# EAGLE design LME49830 Breakout Board (EAGLE 7.1.0)
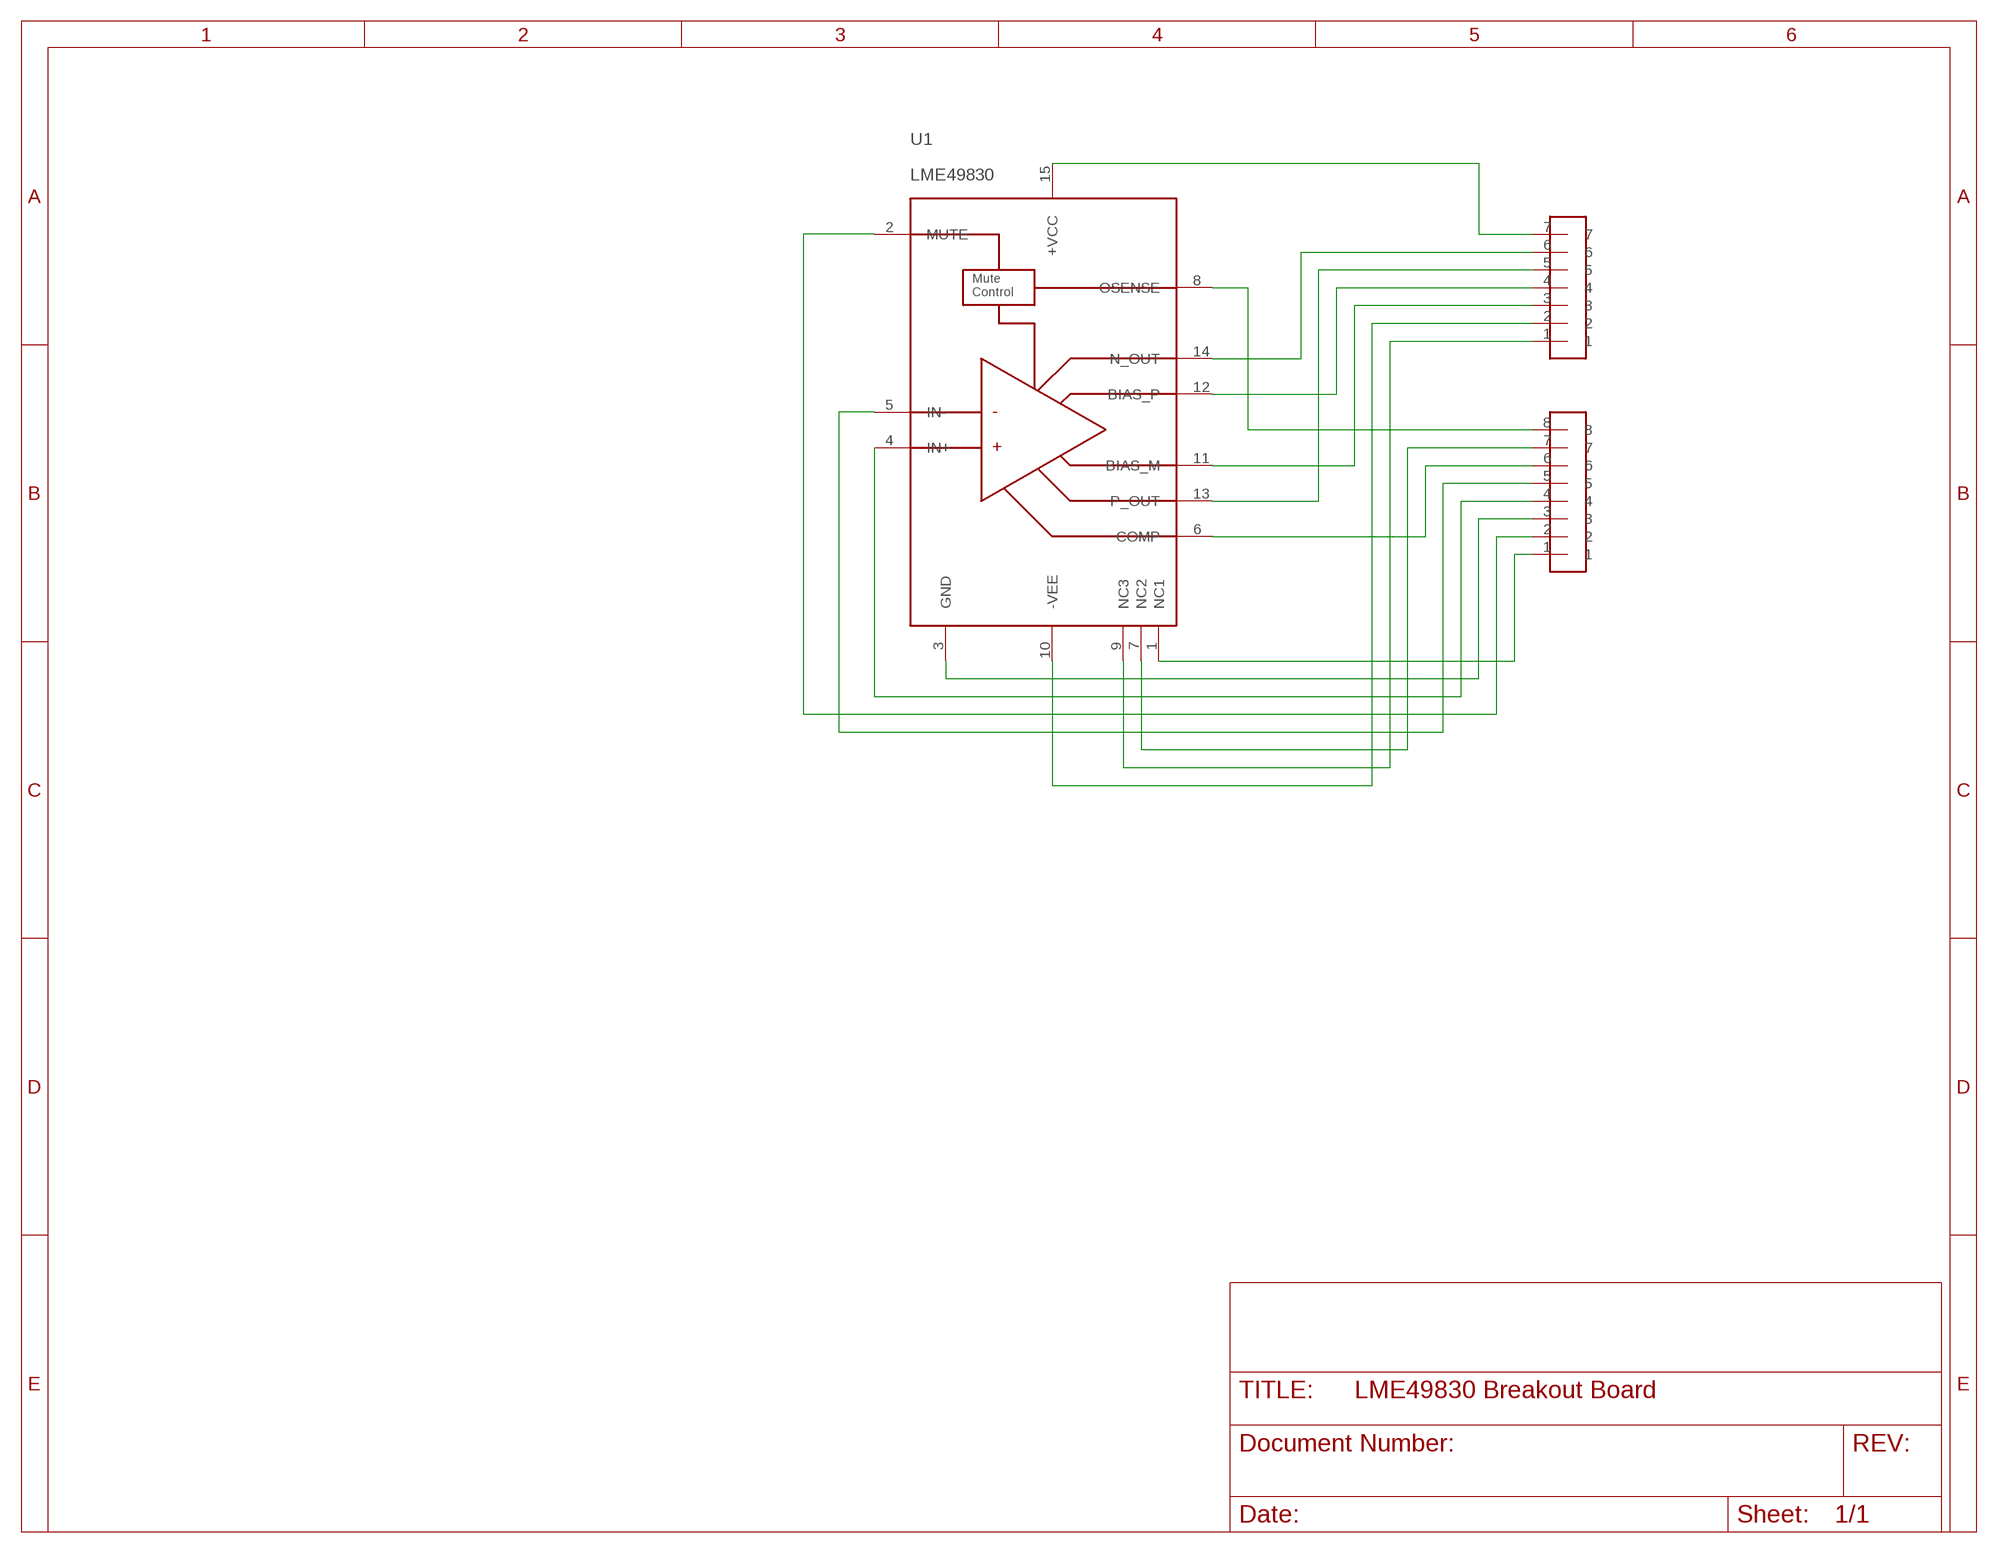
[diagram p0: schematic, sheet 1]

## Parts
U1  LME49830  [NDN0015A]
U$1  1X7HEADER_100MIL  [1X7_100MIL]
U$2  1X8HEADER_100MIL  [1X8_100MIL]

## Nets
N$1: U1.1(NC1) U$2.1
N$2: U1.2(MUTE) U$2.2
N$3: U1.3(GND) U$2.3
N$4: U1.4(IN+) U$2.4
N$5: U1.5(IN-) U$2.5
N$6: U1.6(COMP) U$2.6
N$7: U1.7(NC2) U$2.7
N$8: U1.8(OSENSE) U$2.8
N$9: U1.9(NC3) U$1.1
N$10: U1.10(-VEE) U$1.2
N$11: U1.11(BIAS_M) U$1.3
N$12: U1.12(BIAS_P) U$1.4
N$13: U1.13(P_OUT) U$1.5
N$14: U1.14(N_OUT) U$1.6
N$15: U1.15(+VCC) U$1.7

## Library data of the parts
U1 = texas:LME49830: Mono High Fidelity 200V MOSFET Power Amplifier +/-20V to +/-200V Power Supply
U$1 = Headers:1X7HEADER_100MIL
U$2 = Headers:1X8HEADER_100MIL

## Board
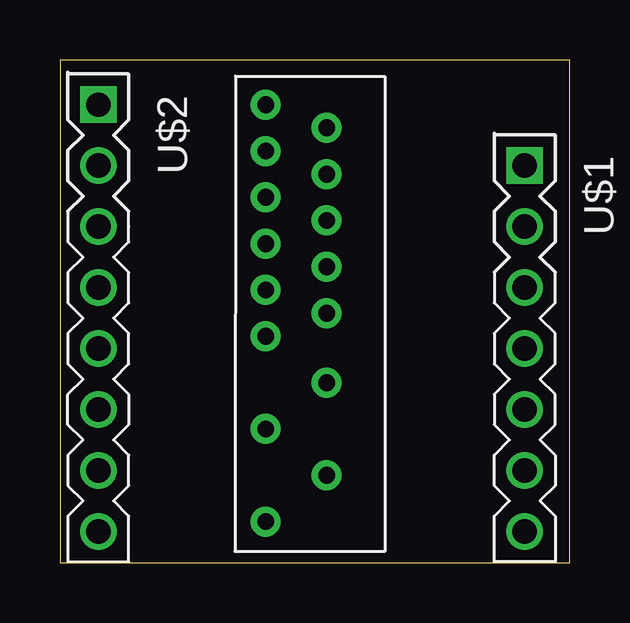
[diagram p1: board, top side]
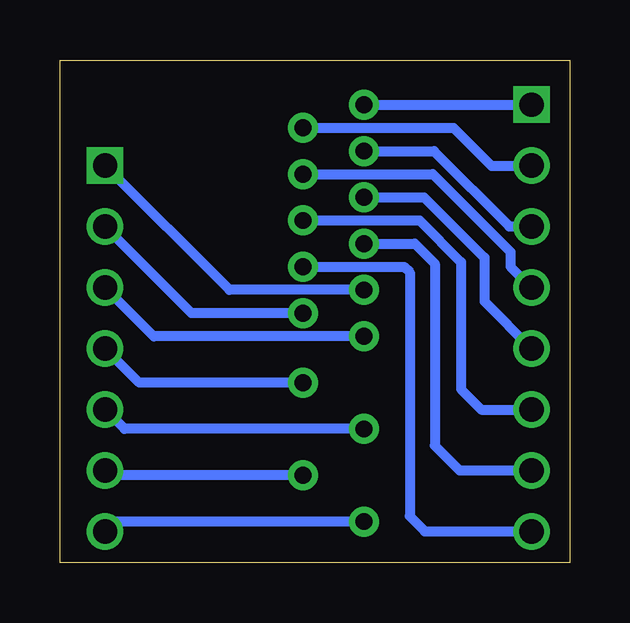
[diagram p2: board, bottom side, seen from below]

Size 21.26 x 20.95 mm. Coordinates in mm from the lower left corner, seen from the top.
Outline: 0,0 21.26,0 21.26,20.95 0,20.95 0,0
Copper layers (1*16): Top 0.035mm / dielectric 1.5mm / Bottom 0.035mm
Design rules "default": minimum track width 10mil, minimum drill 24mil, track to track 8mil, track to pad 8mil, pad to pad 8mil, via to via 8mil, smd to smd 8mil, copper to edge 40mil, drill to drill 8mil, minimum pad ring 10mil, minimum via ring 8mil, stop-mask expansion 4mil, vias tented up to drill 0mil, thermal gap 10mil

### Footprints (pad centres in the part's own frame; a part is rotated, then mirrored left to right if it is on the bottom)
NDN0015A = drill 0.7 pad 1.25: 1 0,0; 2 0.965,2.54; 3 1.93,0; 4 2.895,2.54; 5 3.86,0; 6 4.825,2.54; 7 5.79,0; 8 6.755,2.54; 9 7.72,0; 10 8.685,2.54; 11 9.65,0; 12 11.58,2.54; 13 13.51,0; 14 15.44,2.54; 15 17.37,0
1X7_100MIL = drill 1.016 square: 1 0,0 | drill 1.016: 2 2.54,0; 3 5.08,0; 4 7.62,0; 5 10.16,0; 6 12.7,0; 7 15.24,0
1X8_100MIL = drill 1.016 square: 1 -1.27,0 | drill 1.016: 2 1.27,0; 3 3.81,0; 4 6.35,0; 5 8.89,0; 6 11.43,0; 7 13.97,0; 8 16.51,0

### Placement (x,y rotation side)
U1  8.58,19.08 270 top
U$1  19.38,16.54 270 top
U$2  1.6,17.81 270 top

### Tracks (layer width: path | path; a pad name or v marks a point on that pad's centre or on a via)
N$1
  Bottom 0.406: U1.1 U$2.1
N$2
  Bottom 0.406: U1.2 4.85,18.12 3.27,16.54 U$2.2
N$3
  Bottom 0.406: U1.3 5.67,17.15 2.53,14.02 1.61,14.02 U$2.3
N$4
  Bottom 0.406: U1.4 5.71,16.19 2.47,12.95 2.47,12.34 U$2.4
N$5
  Bottom 0.406: U1.5 6.07,15.22 3.56,12.71 3.56,10.89 U$2.5
N$6
  Bottom 0.406: U1.6 6.27,14.26 4.54,12.53 4.54,7.23 3.69,6.38 U$2.6
N$7
  Bottom 0.406: U1.7 6.46,13.29 5.63,12.46 5.63,4.88 4.59,3.84 U$2.7
N$8
  Bottom 0.406: U1.8 6.91,12.33 6.68,12.1 6.68,1.94 6.04,1.3 U$2.8
N$9
  Bottom 0.406: U1.9 14.2,11.36 U$1.1
N$10
  Bottom 0.406: U1.10 15.77,10.4 U$1.2
N$11
  Bottom 0.406: U1.11 17.35,9.43 U$1.3
N$12
  Bottom 0.406: U1.12 17.96,7.5 U$1.4
N$13
  Bottom 0.406: U1.13 18.57,5.57 U$1.5
N$14
  Bottom 0.406: U1.14 19.18,3.64 U$1.6
N$15
  Bottom 0.406: U1.15 18.97,1.71 U$1.7